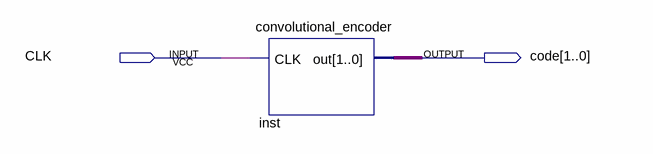
[diagram p0: schematic sheet]
// Quartus schematic conv_encode.bdf as structural Verilog: 1 symbols, 2 pins
module conv_encode (
  input  CLK,
  output [1:0] code
);

  convolutional_encoder inst (.CLK(CLK), .out(code));
endmodule
